# EAGLE design cameo (EAGLE 9.6.2)
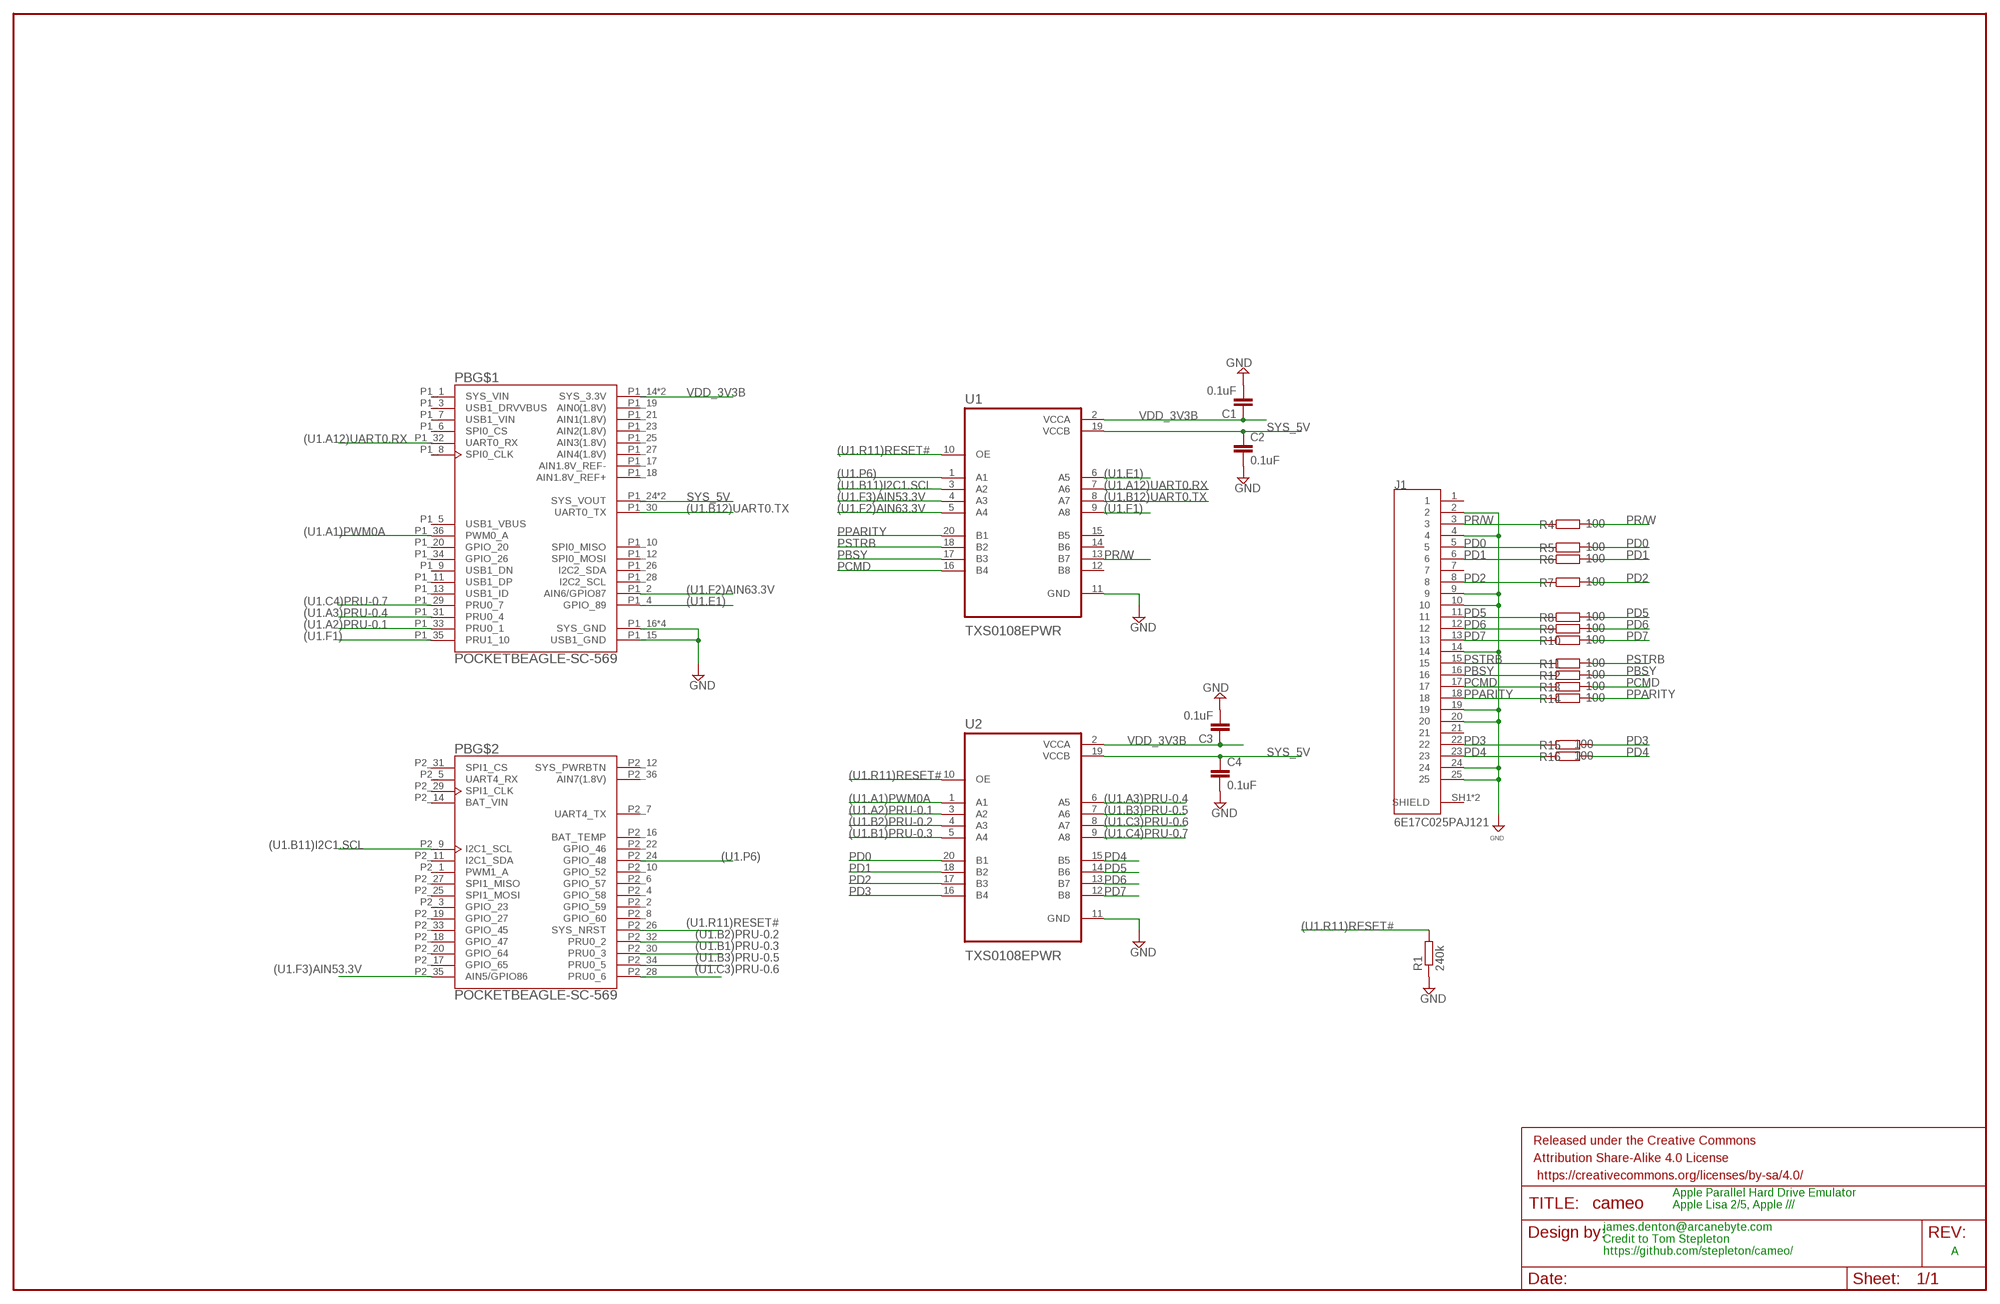
[diagram p0: schematic, sheet 1]

## Parts
C1  0.1uF  C-EUC0603  [C0603]
C2  0.1uF  C-EUC0603  [C0603]
C3  0.1uF  C-EUC0603  [C0603]
C4  0.1uF  C-EUC0603  [C0603]
FRAME1  FRAME-LEDGER  [CREATIVE_COMMONS]
J1  6E17C025PAJ121  [CONN_6E17C025PAJ121]
PB  POCKETBEAGLE-SC-569  [BEAGLE_POCKETBEAGLE-SC-569]
R1  240k  R-EU_R0603  [R0603]
R4  100  R-EU_R0603  [R0603]
R5  100  R-EU_R0603  [R0603]
R6  100  R-EU_R0603  [R0603]
R7  100  R-EU_R0603  [R0603]
R8  100  R-EU_R0603  [R0603]
R9  100  R-EU_R0603  [R0603]
R10  100  R-EU_R0603  [R0603]
R11  100  R-EU_R0603  [R0603]
R12  100  R-EU_R0603  [R0603]
R13  100  R-EU_R0603  [R0603]
R14  100  R-EU_R0603  [R0603]
R15  100  R-EU_R0603  [R0603]
R16  100  R-EU_R0603  [R0603]
U1  TXS0108EPWR  [SOP65P640X120-20N]
U2  TXS0108EPWR  [SOP65P640X120-20N]

## Nets
(U1.A1)PWM0A: PB.P1_36(PWM0_A) U2.1(A1)
(U1.A2)PRU-0.1: PB.P1_33(PRU0_1) U2.3(A2)
(U1.A3)PRU-0.4: PB.P1_31(PRU0_4) U2.6(A5)
(U1.A12)UART0.RX: PB.P1_32(UART0_RX) U1.7(A6)
(U1.B1)PRU-0.3: PB.P2_30(PRU0_3) U2.5(A4)
(U1.B2)PRU-0.2: PB.P2_32(PRU0_2) U2.4(A3)
(U1.B3)PRU-0.5: PB.P2_34(PRU0_5) U2.7(A6)
(U1.B11)I2C1.SCL: PB.P2_9(I2C1_SCL) U1.3(A2)
(U1.B12)UART0.TX: PB.P1_30(UART0_TX) U1.8(A7)
(U1.C3)PRU-0.6: PB.P2_28(PRU0_6) U2.8(A7)
(U1.C4)PRU-0.7: PB.P1_29(PRU0_7) U2.9(A8)
(U1.E1): PB.P1_4(GPIO_89) U1.6(A5)
(U1.F1): PB.P1_35(PRU1_10) U1.9(A8)
(U1.F2)AIN63.3V: PB.P1_2(AIN6/GPIO87) U1.5(A4)
(U1.F3)AIN53.3V: PB.P2_35(AIN5/GPIO86) U1.4(A3)
(U1.P6): PB.P2_24(GPIO_48) U1.1(A1)
(U1.R11)RESET#: PB.P2_26(SYS_NRST) R1.2 U1.10(OE) U2.10(OE)
GND: C1.2 C2.2 C3.2 C4.2 J1.2 J1.4 J1.9 J1.10 J1.14 J1.19 J1.20 J1.24 J1.25 PB.P1_15(USB1_GND) PB.P1_16(SYS_GND) PB.P1_22(SYS_GND) PB.P2_15(SYS_GND) PB.P2_21(SYS_GND) R1.1 U1.11(GND) U2.11(GND)
PBSY: J1.16 R12.1 R12.2 U1.17(B3)
PCMD: J1.17 R13.1 R13.2 U1.16(B4)
PD0: J1.5 R5.1 R5.2 U2.20(B1)
PD1: J1.6 R6.1 R6.2 U2.18(B2)
PD2: J1.8 R7.1 R7.2 U2.17(B3)
PD3: J1.22 R15.1 R15.2 U2.16(B4)
PD4: J1.23 R16.1 R16.2 U2.15(B5)
PD5: J1.11 R8.1 R8.2 U2.14(B6)
PD6: J1.12 R9.1 R9.2 U2.13(B7)
PD7: J1.13 R10.1 R10.2 U2.12(B8)
PPARITY: J1.18 R14.1 R14.2 U1.20(B1)
PR/W: J1.3 R4.1 R4.2 U1.13(B7)
PSTRB: J1.15 R11.1 R11.2 U1.18(B2)
SYS_5V: C2.1 C4.1 PB.P1_24(SYS_VOUT) PB.P2_13(SYS_VOUT) U1.19(VCCB) U2.19(VCCB)
VDD_3V3B: C1.1 C3.1 PB.P1_14(SYS_3.3V) PB.P2_23(SYS_3.3V) U1.2(VCCA) U2.2(VCCA)
Unconnected: J1.1 J1.7 J1.21 J1.SH1(SHIELD) J1.SH2(SHIELD) PB.P1_1(SYS_VIN) PB.P1_3(USB1_DRVVBUS) PB.P1_5(USB1_VBUS) PB.P1_6(SPI0_CS) PB.P1_7(USB1_VIN) PB.P1_8(SPI0_CLK) PB.P1_9(USB1_DN) PB.P1_10(SPI0_MISO) PB.P1_11(USB1_DP) PB.P1_12(SPI0_MOSI) PB.P1_13(USB1_ID) PB.P1_20(GPIO_20) PB.P1_26(I2C2_SDA) PB.P1_28(I2C2_SCL) PB.P1_34(GPIO_26) PB.P2_1(PWM1_A) PB.P2_2(GPIO_59) PB.P2_3(GPIO_23) PB.P2_4(GPIO_58) PB.P2_5(UART4_RX) PB.P2_6(GPIO_57) PB.P2_7(UART4_TX) PB.P2_8(GPIO_60) PB.P2_10(GPIO_52) PB.P2_11(I2C1_SDA) PB.P2_14(BAT_VIN) PB.P2_16(BAT_TEMP) PB.P2_17(GPIO_65) PB.P2_18(GPIO_47) PB.P2_19(GPIO_27) PB.P2_20(GPIO_64) PB.P2_22(GPIO_46) PB.P2_25(SPI1_MOSI) PB.P2_27(SPI1_MISO) PB.P2_29(SPI1_CLK) PB.P2_31(SPI1_CS) PB.P2_33(GPIO_45) U1.12(B8) U1.14(B6) U1.15(B5)

## Notes on the sheet
- Apple Parallel Hard Drive Emulator
  Apple Lisa 2/5, Apple ///
- james.denton@arcanebyte.com
  Credit to Tom Stepleton
  https://github.com/stepleton/cameo/
- A

## Power pins joined to a net without a drawn wire
AIN0(1.8V): PB.P1_19(AIN0(1.8V))
AIN1(1.8V): PB.P1_21(AIN1(1.8V))
AIN1.8V_REF+: PB.P1_18(AIN1.8V_REF+)
AIN1.8V_REF-: PB.P1_17(AIN1.8V_REF-)
AIN2(1.8V): PB.P1_23(AIN2(1.8V))
AIN3(1.8V): PB.P1_25(AIN3(1.8V))
AIN4(1.8V): PB.P1_27(AIN4(1.8V))
AIN7(1.8V): PB.P2_36(AIN7(1.8V))
SYS_PWRBTN: PB.P2_12(SYS_PWRBTN)

## Library data of the parts
C1-C4 = rcl:C-EU: CAPACITOR, European symbol; SPICEPREFIX: C
FRAME1 = SparkFun-Aesthetics:FRAME-LEDGER: Schematic Frame - Ledger Standard 11x14 US Ledger frame
J1 = 6E17C025PAJ121:6E17C025PAJ121: Conn D-Subminiature PIN 25 POS 2.76mm Solder RA Thru-Hole 25 Terminal 1 Port; DESCRIPTION: Conn D-Subminiature PIN 25 POS 2.76mm Solder RA Thru-Hole 25 Terminal 1 Port; MF: Amphenol; MP: 6E17C025PAJ121; PACKAGE: None
PB = POCKETBEAGLE-SC-569:POCKETBEAGLE-SC-569: DEV BOARD POCKETBEAGLE Check prices <https://pricing.snapeda.com/parts/POCKETBEAGLE-SC-569/GHI%20Electronics%2C/view-part?ref=eda>; AVAILABILITY: Warning; DESCRIPTION: OSD3358 PocketBeagle - ARM® Cortex®-A8 MPU Embedded Evaluation Board; MF: GHI Electronics,; MP: POCKETBEAGLE-SC-569; PACKAGE: None; PRICE: None; PURCHASE-URL: https://pricing.snapeda.com/search/part/POCKETBEAGLE-SC-569/?ref=eda
R1 R4-R16 = rcl:R-EU_: RESISTOR, European symbol; SPICEPREFIX: R
U1 U2 = TXS0108EPWR:TXS0108EPWR; DESCRIPTION: 8-bit bidirectional voltage-level shifter for open-drain and push-pull application 20-TSSOP -40 to 85; DIGI-KEY_PART_NUMBER: 296-23011-1-ND; MF: Texas Instruments; MP: TXS0108EPWR; PACKAGE: TSSOP-20 Texas Instruments; PURCHASE-URL: https://pricing.snapeda.com/search/part/TXS0108EPWR/?ref=eda

## Board
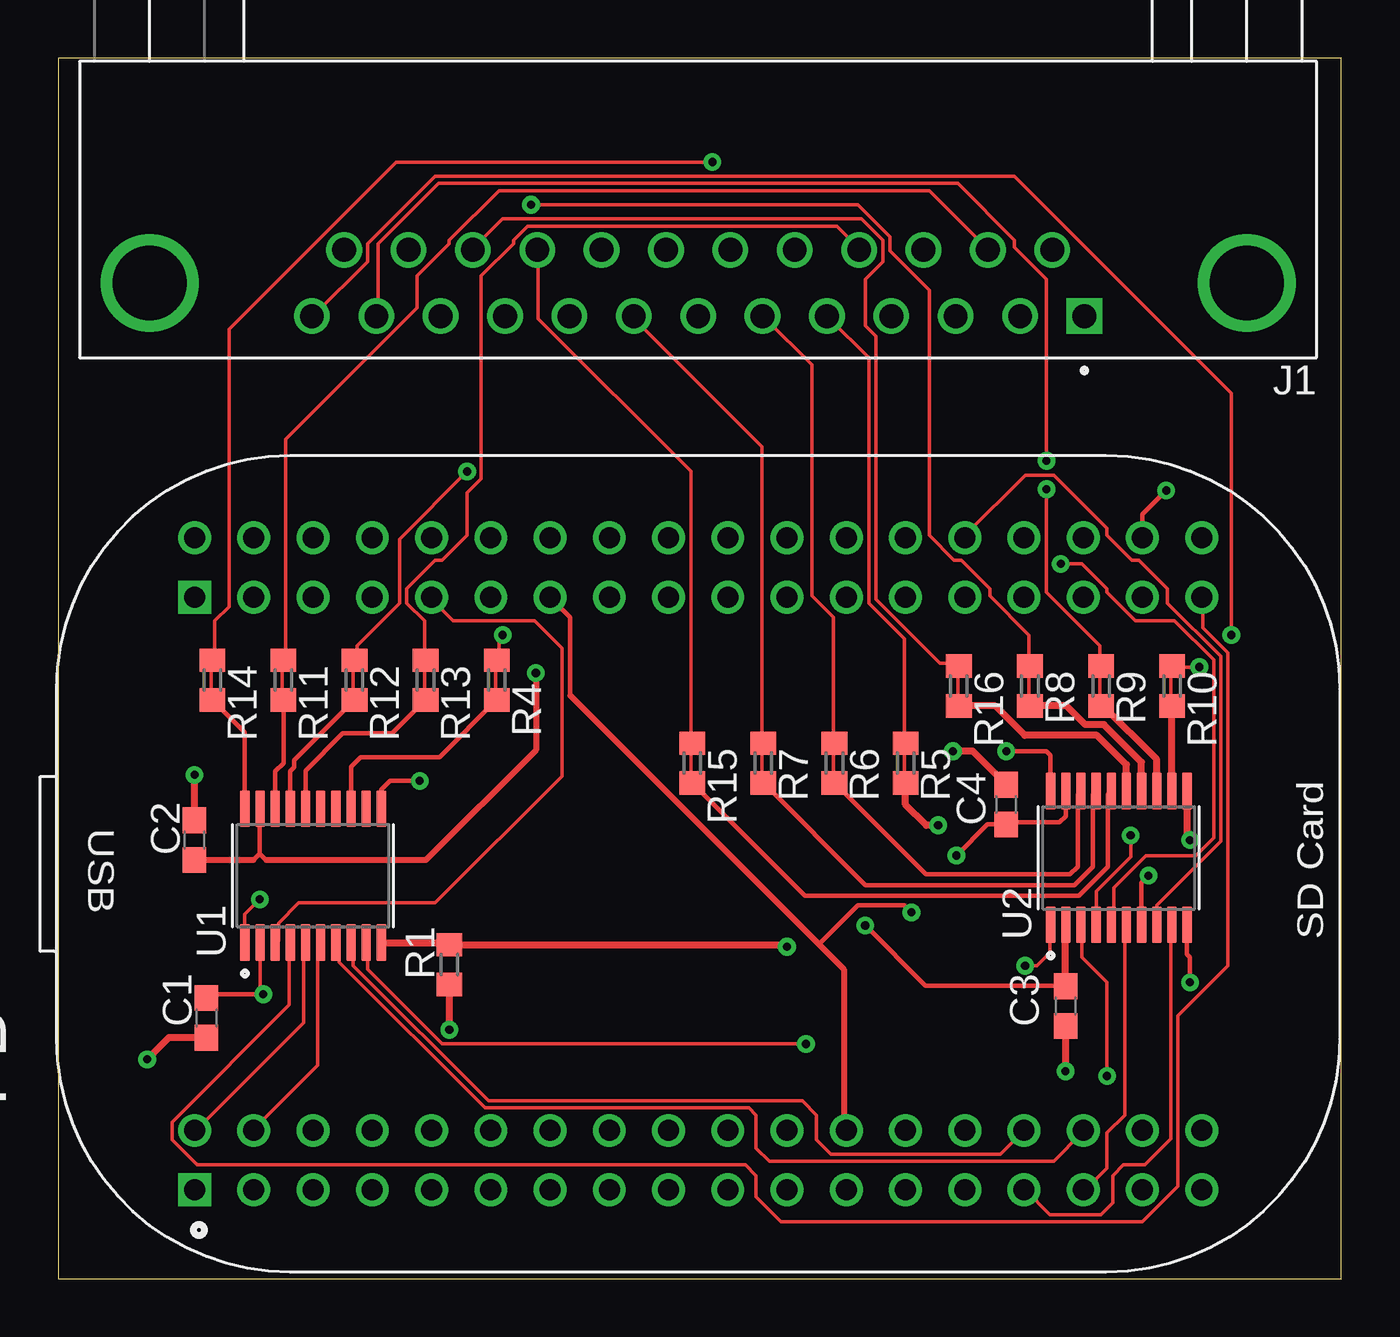
[diagram p1: board, top side]
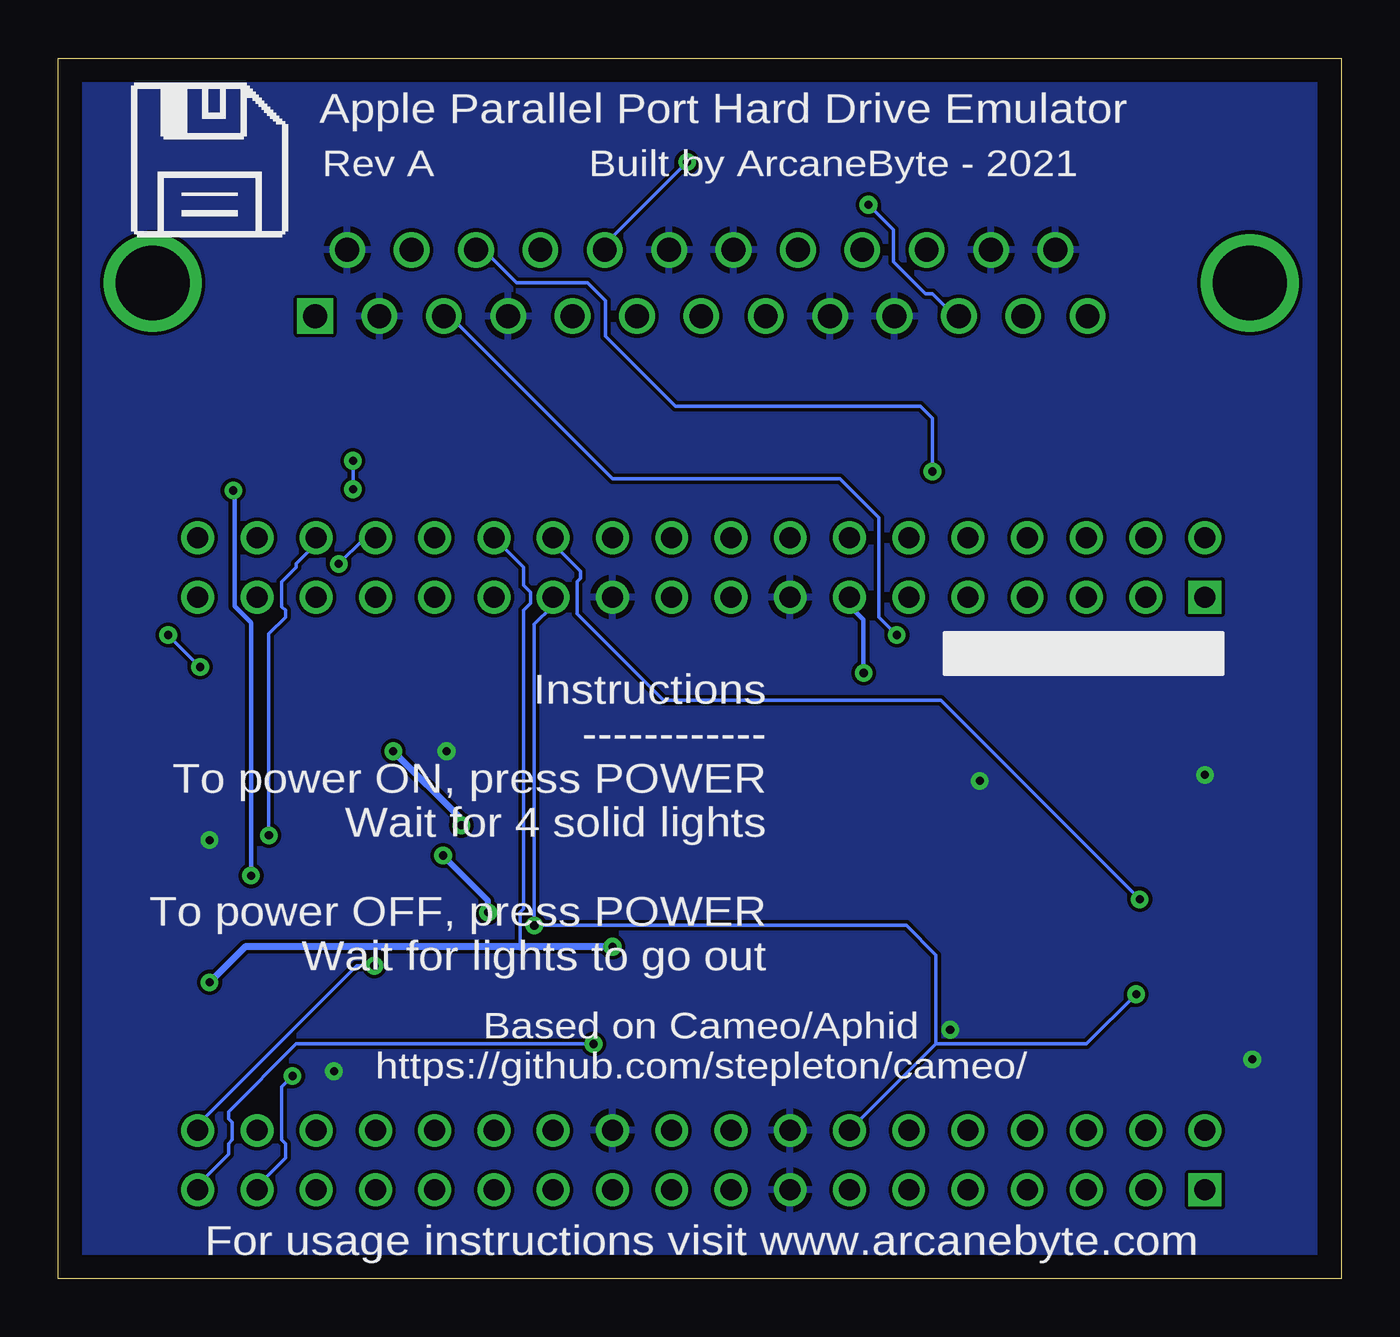
[diagram p2: board, bottom side, seen from below]

Size 55 x 52.3 mm. Coordinates in mm from the lower left corner, seen from the top.
Outline: 0,0 55,0 55,52.3 0,52.3 0,0
Copper layers (1*16): Top 0.035mm / dielectric 1.5mm / Bottom 0.035mm
Design rules "default": minimum track width 6mil, minimum drill 0.35mm, track to track 6mil, track to pad 6mil, pad to pad 6mil, via to via 6mil, smd to smd 6mil, copper to edge 40mil, drill to drill 6mil, minimum pad ring 10mil, minimum via ring 8mil, stop-mask expansion 4mil, vias tented up to drill 0mil, thermal gap 10mil

### Footprints (pad centres in the part's own frame; a part is rotated, then mirrored left to right if it is on the bottom)
C0603 = smd 1.1 x 1: 1 -0.85,0; 2 0.85,0
CONN_6E17C025PAJ121 = drill 1.02 square: 1 -16.56,1.42 | drill 1.02: 2 -13.8,1.42; 3 -11.04,1.42; 4 -8.28,1.42; 5 -5.52,1.42; 6 -2.76,1.42; 7 0,1.42; 8 2.76,1.42; 9 5.52,1.42; 10 8.28,1.42; 11 11.04,1.42; 12 13.8,1.42; 13 16.56,1.42; 14 -15.18,-1.42; 15 -12.42,-1.42; 16 -9.66,-1.42; 17 -6.9,-1.42; 18 -4.14,-1.42; 19 -1.38,-1.42; 20 1.38,-1.42; 21 4.14,-1.42; 22 6.9,-1.42; 23 9.66,-1.42; 24 12.42,-1.42; 25 15.18,-1.42 | drill 3.18: SH1 -23.52,0; SH2 23.52,0
BEAGLE_POCKETBEAGLE-SC-569 = drill 0.9 square: P1_1 -13.97,21.59; P2_1 11.43,21.59 | drill 0.9: P1_2 -11.43,21.59; P1_3 -13.97,19.05; P1_4 -11.43,19.05; P1_5 -13.97,16.51; P1_6 -11.43,16.51; P1_7 -13.97,13.97; P1_8 -11.43,13.97; P1_9 -13.97,11.43; P1_10 -11.43,11.43; P1_11 -13.97,8.89; P1_12 -11.43,8.89; P1_13 -13.97,6.35; P1_14 -11.43,6.35; P1_15 -13.97,3.81; P1_16 -11.43,3.81; P1_17 -13.97,1.27; P1_18 -11.43,1.27; P1_19 -13.97,-1.27; P1_20 -11.43,-1.27; P1_21 -13.97,-3.81; P1_22 -11.43,-3.81; P1_23 -13.97,-6.35; P1_24 -11.43,-6.35; P1_25 -13.97,-8.89; P1_26 -11.43,-8.89; P1_27 -13.97,-11.43; P1_28 -11.43,-11.43; P1_29 -13.97,-13.97; P1_30 -11.43,-13.97; P1_31 -13.97,-16.51; P1_32 -11.43,-16.51; P1_33 -13.97,-19.05; P1_34 -11.43,-19.05; P1_35 -13.97,-21.59; P1_36 -11.43,-21.59; P2_2 13.97,21.59; P2_3 11.43,19.05; P2_4 13.97,19.05; P2_5 11.43,16.51; P2_6 13.97,16.51; P2_7 11.43,13.97; P2_8 13.97,13.97; P2_9 11.43,11.43; P2_10 13.97,11.43; P2_11 11.43,8.89; P2_12 13.97,8.89; P2_13 11.43,6.35; P2_14 13.97,6.35; P2_15 11.43,3.81; P2_16 13.97,3.81; P2_17 11.43,1.27; P2_18 13.97,1.27; P2_19 11.43,-1.27; P2_20 13.97,-1.27; P2_21 11.43,-3.81; P2_22 13.97,-3.81; P2_23 11.43,-6.35; P2_24 13.97,-6.35; P2_25 11.43,-8.89; P2_26 13.97,-8.89; P2_27 11.43,-11.43; P2_28 13.97,-11.43; P2_29 11.43,-13.97; P2_30 13.97,-13.97; P2_31 11.43,-16.51; P2_32 13.97,-16.51; P2_33 11.43,-19.05; P2_34 13.97,-19.05; P2_35 11.43,-21.59; P2_36 13.97,-21.59
R0603 = smd 1 x 1.1: 1 -0.85,0; 2 0.85,0
SOP65P640X120-20N = smd 1.57 x 0.41: 1 -2.87,2.925; 2 -2.87,2.275; 3 -2.87,1.625; 4 -2.87,0.975; 5 -2.87,0.325; 6 -2.87,-0.325; 7 -2.87,-0.975; 8 -2.87,-1.625; 9 -2.87,-2.275; 10 -2.87,-2.925; 11 2.87,-2.925; 12 2.87,-2.275; 13 2.87,-1.625; 14 2.87,-0.975; 15 2.87,-0.325; 16 2.87,0.325; 17 2.87,0.975; 18 2.87,1.625; 19 2.87,2.275; 20 2.87,2.925

### Placement (x,y rotation side)
C1  6.35,11.18 270 top
C2  5.84,18.8 90 top
C3  43.18,11.68 270 top
C4  40.64,20.32 90 top
FRAME1  15.75,-7.87 0 top  (outside the outline)
J1  27.43,42.67 180 top
PB  27.43,17.78 90 top
R1  16.76,13.46 90 top
R4  18.8,25.65 90 top
R5  36.32,22.1 270 top
R6  33.27,22.1 270 top
R7  30.23,22.1 270 top
R8  41.66,25.4 270 top
R9  44.7,25.4 270 top
R10  47.75,25.4 270 top
R11  9.65,25.65 270 top
R12  12.7,25.65 270 top
R13  15.75,25.65 270 top
R14  6.6,25.65 270 top
R15  27.18,22.1 270 top
R16  38.61,25.4 270 top
U1  10.92,17.27 90 top
U2  45.47,18.03 90 top

### Tracks (layer width: path | path; a pad name or v marks a point on that pad's centre or on a via)
(U1.A1)PWM0A  (via drill 0.35)
  Top 0.152: v41.45,13.41 41.96,13.41 42.52,13.97 42.52,15.09 U2.1
  Bottom 0.152: PB.P1_36 49.02,6.6 42.22,13.41 v41.45,13.41
(U1.A2)PRU-0.1  (via drill 0.35)
  Top 0.152: v44.96,8.69 44.96,12.7 43.89,13.77 43.89,15.09 U2.3
  Bottom 0.152: v44.96,8.69 45.41,8.23 45.41,5.94 45.26,5.79 45.26,5.18 46.48,3.96 PB.P1_33
(U1.A3)PRU-0.4
  Top 0.152: U2.6 45.72,15.09 45.72,7.01 44.96,6.25 44.96,4.72 44.04,3.81 PB.P1_31
(U1.A12)UART0.RX
  Top 0.152: U1.7 12.04,14.33 12.04,13.56 18.29,7.32 29.62,7.32 29.92,7.01 29.92,5.59 30.48,5.03 42.67,5.03 43.89,6.25 PB.P1_32
(U1.B1)PRU-0.3  (via drill 0.35)
  Top 0.152: v42.98,30.63 43.89,30.63 44.96,29.57 44.96,29.41 46.18,28.19 47.85,28.19 49.53,26.52 49.53,18.9 48.77,18.14 46.63,18.14 45.26,16.76 45.26,15.24 U2.5
  Bottom 0.152: v42.98,30.63 41.91,31.7 41.45,31.7 PB.P2_30
(U1.B2)PRU-0.2  (via drill 0.35)
  Top 0.152: v45.97,19 45.97,18.09 44.5,16.61 44.5,15.24 U2.4
  Bottom 0.152: v45.97,19 45.97,27.64 45.26,28.35 45.26,28.65 45.41,28.8 45.41,29.87 44.81,30.48 44.81,30.63 44.04,31.39 44.04,31.7 PB.P2_32
(U1.B3)PRU-0.5  (via drill 0.35)
  Top 0.203: U2.7 46.44,16.98 v46.74,17.27 | v47.5,33.78 46.48,32.77 PB.P2_34
  Bottom 0.203: v46.74,17.27 46.74,28.11 47.44,28.81 47.44,33.72 v47.5,33.78
(U1.B11)I2C1.SCL
  Top 0.152: U1.3 9.45,14.48 9.45,15.24 10.31,16.1 16.15,16.1 21.59,21.54 21.59,27.03 20.42,28.19 16.92,28.19 16,29.11 PB.P2_9
(U1.B12)UART0.TX
  Top 0.152: PB.P1_30 40.39,5.33 33.12,5.33 32.51,5.94 32.51,7.01 31.9,7.62 18.44,7.62 12.65,13.41 12.65,14.33 U1.8
(U1.C3)PRU-0.6
  Top 0.152: U2.8 47.09,15.24 47.09,16 49.84,18.75 49.84,26.67 47.55,28.96 47.55,29.57 46.33,30.79 46.02,30.79 44.96,31.85 44.96,32.16 42.67,34.44 41.45,34.44 38.86,31.85 PB.P2_28
(U1.C4)PRU-0.7
  Top 0.152: U2.9 47.7,15.09 47.7,5.99 46.58,4.88 45.67,4.88 45.21,4.42 45.21,3.25 44.7,2.74 42.52,2.74 41.45,3.81 PB.P1_29
(U1.E1)
  Top 0.152: U1.6 11.12,14.33 11.12,9.14 8.38,6.4 PB.P1_4
(U1.F1)  (via drill 0.35)
  Top 0.152: v32.05,10.06 16.46,10.06 13.26,13.26 13.26,14.33 U1.9
  Bottom 0.152: v32.05,10.06 44.81,10.06 47.7,7.16 47.7,6.86 47.55,6.71 47.55,5.94 47.7,5.79 47.7,5.33 48.92,4.12 48.92,3.81 PB.P1_35
(U1.F2)AIN63.3V
  Top 0.152: U1.5 10.52,14.33 10.52,10.97 5.94,6.4 PB.P1_2
(U1.F3)AIN53.3V
  Top 0.152: U1.4 9.91,14.33 9.91,11.73 4.88,6.71 4.88,5.94 5.94,4.88 29.46,4.88 29.92,4.42 29.92,3.5 30.99,2.44 46.48,2.44 48.01,3.96 48.01,11.28 50.14,13.41 50.14,26.82 49.07,27.89 49.07,29.11 PB.P2_35
(U1.P6)  (via drill 0.35)
  Top 0.152: U1.1 8,15.62 v8.64,16.26
  Bottom 0.152: v8.64,16.26 17.17,24.79 29.06,24.79 32.77,28.5 32.77,29.87 32.61,30.02 32.61,30.33 33.68,31.39 33.68,31.7 PB.P2_24
(U1.R11)RESET#  (via drill 0.35)
  Top 0.203: U2.10 48.39,13.89 48.51,13.77 v48.51,12.7
  Top 0.305: U1.10 16.67,14.4 R1.2 31.24,14.31 v31.24,14.22
  Bottom 0.152: PB.P2_26 35.05,30.48 35.05,29.72 34.75,29.41 34.75,28.96 35.05,28.65 35.05,15.85 35.2,15.7 35.2,14.22
  Bottom 0.305: v31.24,14.22 35.2,14.22 46.99,14.22 v48.51,12.7
GND  (via drill 0.35)
  Top 0.203: U1.11 13.85,20.96 14.22,21.34 v15.49,21.34
  Top 0.305: R1.1 v16.76,10.67 | U2.11 48.39,18.92 v48.51,18.8 | C1.2 4.74,10.33 v3.81,9.4 | C3.2 v43.18,8.89 | C4.2 39.2,22.61 v38.35,22.61 | C2.2 v5.84,21.59
  pour Bottom: 0.51,51.82 54.61,51.82 54.61,1.02 54.36,0.76 0.51,0.76
PBSY  (via drill 0.35)
  Top 0.152: R12.2 12.65,24.84 12.65,26.36 R12.1 12.8,26.52 12.8,27.13 14.63,28.96 14.63,31.7 v17.53,34.59
  Top 0.203: R12.2 10.11,22.21 10.11,21.91 9.95,21.75 U1.17
  Bottom 0.152: v17.53,34.59 17.53,36.88 18.03,37.39 28.55,37.39 31.55,40.39 31.55,41.91 32.31,42.67 35.36,42.67 36.73,44.04 37.03,44.04 J1.16
PCMD
  Top 0.152: R13.2 15.7,24.84 15.7,26.36 R13.1 15.7,26.52 15.7,28.19 14.94,28.96 14.94,29.57 16.15,30.79 16.46,30.79 17.53,31.85 17.53,33.68 18.14,34.29 18.14,42.98 19.51,44.35 19.51,44.5 20.12,45.11 33.38,45.11 34.29,44.2 J1.17
  Top 0.203: R13.2 14.31,23.37 12.19,23.37 10.6,21.77 U1.16
PD0  (via drill 0.35)
  Top 0.152: R5.2 36.27,21.34 36.27,22.86 R5.1 36.27,23.01 36.27,27.43 34.75,28.96 34.75,39.47 33.07,41.15 J1.5
  Top 0.203: U2.20 42.54,22.43 42.36,22.61 v40.64,22.61
  Top 0.305: v37.72,19.43 37.21,19.43 36.32,20.32 R5.2
  Bottom 0.305: v37.72,19.43 37.72,19.68 v40.64,22.61
PD1
  Top 0.152: R6.2 33.22,21.34 33.22,22.86 R6.1 33.22,23.01 33.22,28.35 32.31,29.26 32.31,39.17 30.33,41.15 J1.6
  Top 0.203: U2.18 43.7,20.76 43.7,17.65 43.37,17.32 37.2,17.32 R6.2
PD2
  Top 0.152: R7.2 30.18,21.34 30.18,22.86 R7.1 30.18,23.01 30.18,35.66 24.69,41.15 J1.8
  Top 0.203: U2.17 44.35,20.76 44.35,17.66 43.56,16.87 34.61,16.87 R7.2
PD3
  Top 0.152: R15.2 27.13,21.34 27.13,22.86 R15.1 27.13,23.01 27.13,34.59 20.57,41.15 20.57,44.04 J1.22
  Top 0.203: U2.16 45,20.76 45,17.66 43.75,16.41 32.02,16.41 R15.2
PD4
  Top 0.152: R16.2 38.56,24.69 38.56,26.21 R16.1 38.56,26.36 37.8,26.36 35.05,29.11 35.05,40.39 34.59,40.84 34.59,42.82 35.36,43.59 35.36,44.5 34.44,45.41 19.05,45.41 17.83,44.2 J1.23
  Top 0.305: U2.15 45.79,22.03 44.53,23.29 41.44,23.29 40.17,24.55 R16.2
PD5  (via drill 0.35)
  Top 0.152: R8.2 41.6,24.69 41.6,26.21 R8.1 41.6,26.36 41.6,27.58 39.93,29.26 39.93,29.57 38.71,30.79 38.41,30.79 37.34,31.85 37.34,42.37 35.66,44.04 35.66,44.65 34.29,46.02 v20.27,46.02
  Top 0.305: U2.14 46.44,22.14 44.84,23.75 44.03,23.75 43.22,24.55 R8.2
  Bottom 0.152: v20.27,46.02 19.2,44.96 19.2,43.59 17.83,42.22 17.53,42.22 16.46,41.15 J1.11
PD6  (via drill 0.35)
  Top 0.152: R9.2 44.65,24.69 44.65,26.21 R9.1 44.65,26.36 44.65,27.13 42.37,29.41 v42.37,33.83 | v42.37,35.05 42.37,42.82 41,44.2 41,44.5 38.56,46.94 16.31,46.94 13.72,44.35 13.72,41.3 J1.12
  Top 0.305: U2.13 47.09,22.25 44.79,24.55 R9.2
  Bottom 0.152: v42.37,35.05 v42.37,33.83
PD7  (via drill 0.35)
  Top 0.152: R10.2 47.7,24.69 47.7,26.21 R10.1 47.85,26.21 v48.92,26.21 | v50.29,27.58 50.29,37.95 41,47.24 16.15,47.24 13.26,44.35 13.26,43.59 10.97,41.3 J1.13
  Top 0.305: U2.12 R10.2
  Bottom 0.152: v50.29,27.58 v48.92,26.21
PPARITY  (via drill 0.35)
  Top 0.152: R14.2 6.55,24.84 6.55,26.36 R14.1 6.71,26.52 6.71,28.19 7.32,28.8 7.32,40.69 14.48,47.85 v28.04,47.85
  Top 0.203: R14.2 8,23.41 U1.20
  Bottom 0.152: v28.04,47.85 31.7,44.2 J1.18
PR/W  (via drill 0.35)
  Top 0.152: R4.1 18.75,24.84 18.75,26.36 R4.2 18.9,26.52 18.9,27.43 v19.05,27.58
  Top 0.203: R4.1 16.34,22.35 12.95,22.35 12.55,21.95 U1.13
  Bottom 0.152: v19.05,27.58 19.81,28.35 19.81,32.61 21.49,34.29 31.24,34.29 38.1,41.15 38.41,41.15 J1.3
PSTRB
  Top 0.152: R11.2 9.6,24.84 9.6,26.36 R11.1 9.75,26.52 9.75,35.97 15.39,41.6 15.39,42.98 16.76,44.35 16.76,44.5 18.9,46.63 37.34,46.63 39.78,44.2 J1.15
  Top 0.203: R11.2 9.65,22.1 9.3,21.74 U1.18
SYS_5V  (via drill 0.35)
  Top 0.152: 33.68,6.4 PB.P1_24 | 36.27,16 v36.58,15.7 | 8.64,20.13 U1.19 | C4.1 40.73,19.56
  Top 0.203: 21.95,24.99 21.95,28.35 PB.P2_13 | 36.27,16 34.29,16 32.61,14.33 | 8.37,17.95 8.64,18.21 | 8.64,18.21 8.64,20.13 | 8.92,17.93 8.64,18.21 | v38.51,18.14 39.84,19.47 C4.1 | 40.73,19.56 42.93,19.56 43.19,19.82 U2.19
  Top 0.254: 33.68,6.4 33.68,13.26 32.61,14.33 21.95,24.99 | v20.47,25.96 20.47,22.66 15.75,17.93 8.92,17.93 | C2.1 8.37,17.95
  Bottom 0.152: 21.03,28.8 21.03,29.11 PB.P2_13
  Bottom 0.203: v20.47,25.96 20.47,28.25 21.03,28.8
  Bottom 0.254: v36.58,15.7 36.58,16.2 v38.51,18.14
VDD_3V3B  (via drill 0.35)
  Top 0.152: C1.1 6.52,12.19 | v8.79,12.19 8.65,12.33 U1.2
  Top 0.203: C3.1 43.17,12.55 37.19,12.55 v34.59,15.14 | v8.79,12.19 6.52,12.19
  Top 0.305: C3.1 U2.2
  Bottom 0.152: 17.37,10.06 PB.P1_14 | 17.37,10.06 10.92,10.06 v8.79,12.19 | PB.P2_23 33.83,29.11 33.83,28.8 34.59,28.04 v34.59,15.14 18.64,15.14 17.37,13.87 17.37,10.06

### Text on the board
tPlace: SD Card | USB
bPlace: Apple Parallel Port Hard Drive Emulator | Built by ArcaneByte - 2021 | Rev A | Instructions / ------------ / To power ON, press POWER / Wait for 4 solid lights / / To power OFF, press POWER / Wait for lights to go out | Based on Cameo/Aphid / https://github.com/stepleton/cameo/ | For usage instructions visit www.arcanebyte.com